# Altium schematic sheet MK76_HOST__A.SchDoc
size D; Organization: Altium Limited; Address1: 3 Minna Close; Address2: Belrose; Address3: NSW 2085; Address4: Australia; DocumentNumber: 1; SheetNumber: 1; SheetTotal: 1; PAGE_TITLE: TOP LEVEL
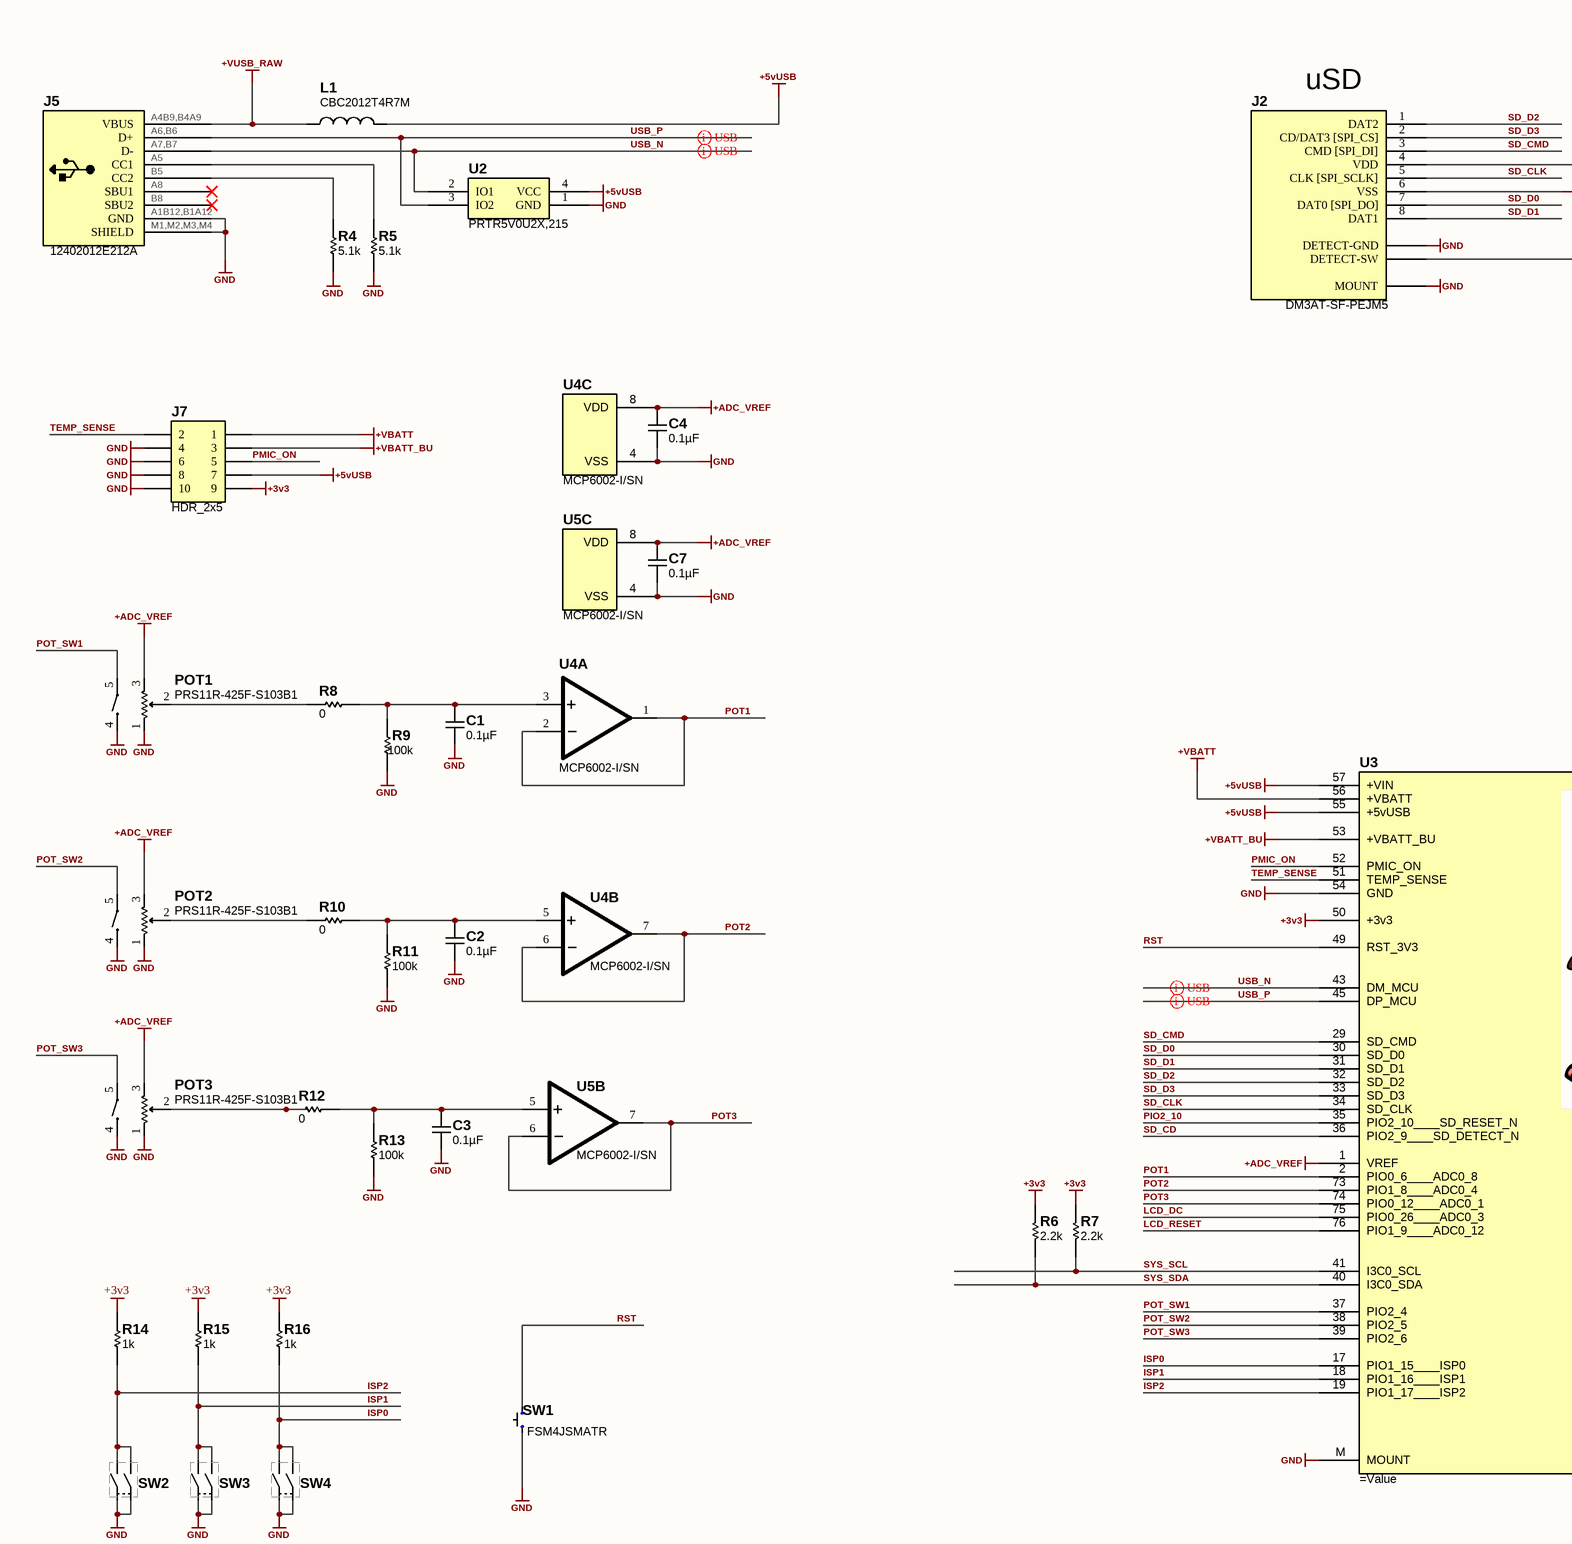
[diagram p0: MK76_HOST__A.SchDoc, top left]
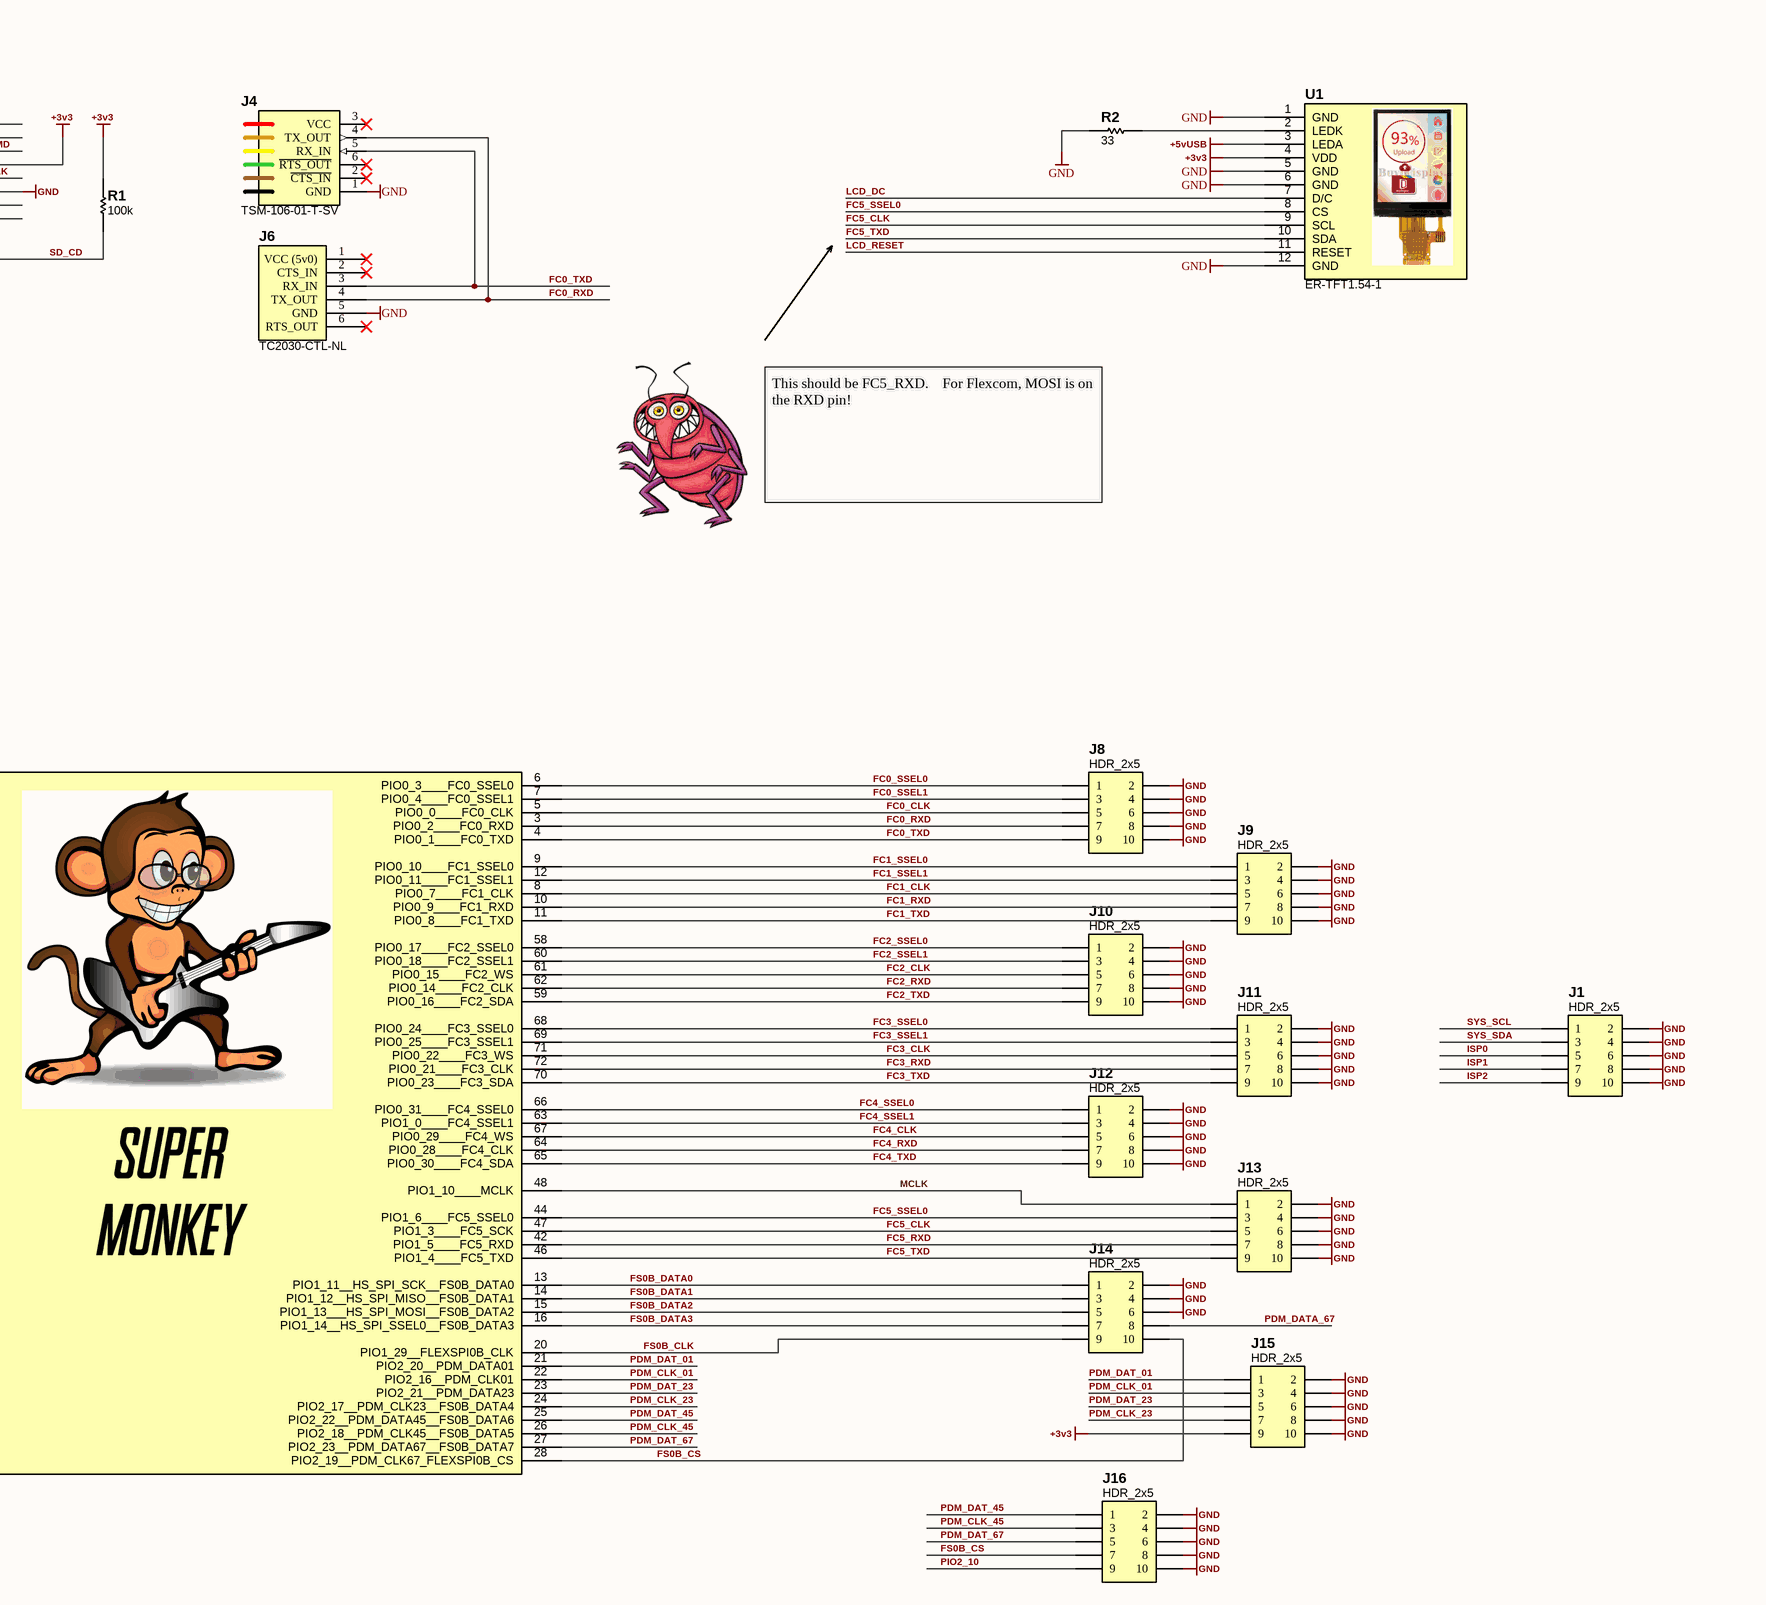
[diagram p1: MK76_HOST__A.SchDoc, top right]
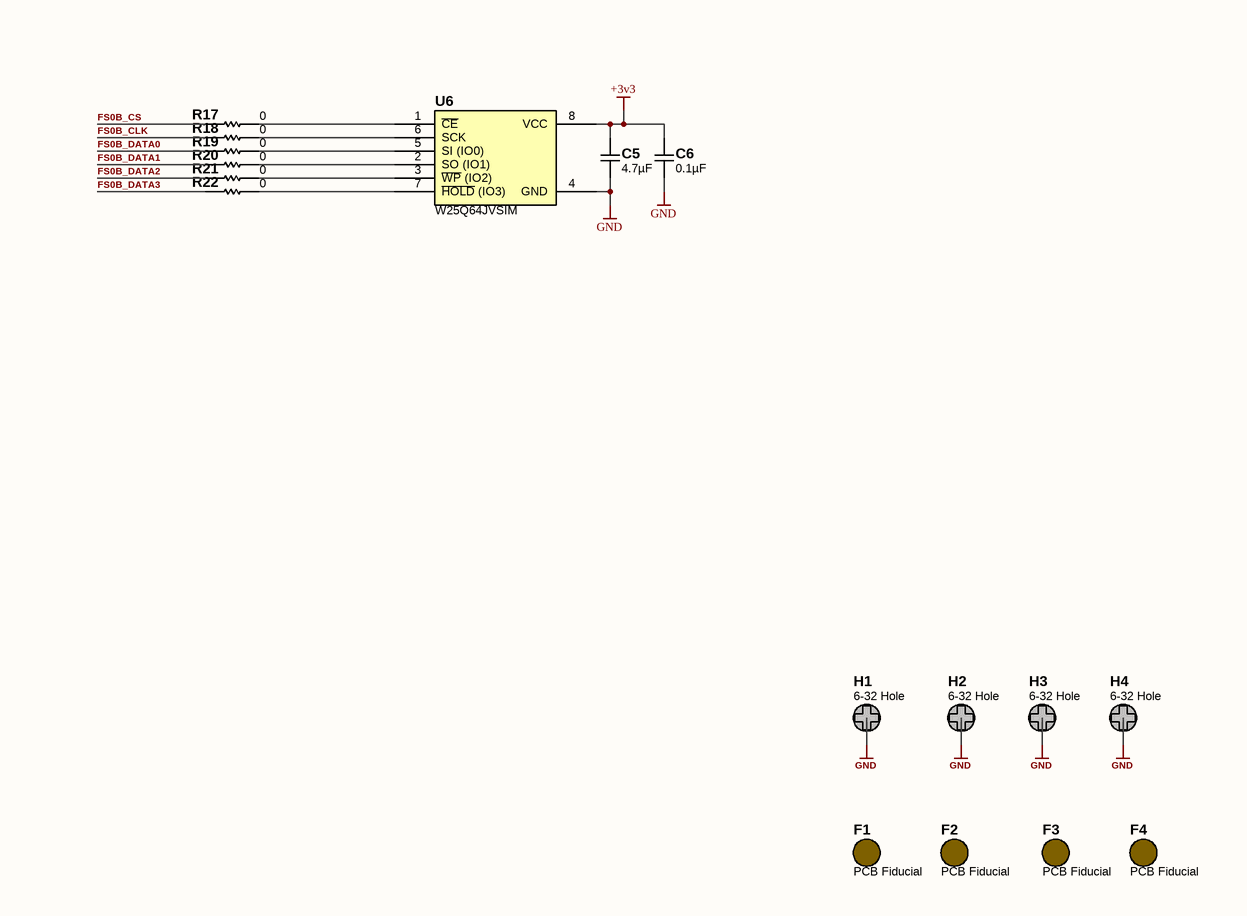
[diagram p2: MK76_HOST__A.SchDoc, bottom right]

## Parts
C1  0.1µF  [C0603_0.90MM_MD]
C2  0.1µF  [C0603_0.90MM_MD]
C3  0.1µF  [C0603_0.90MM_MD]
C4  0.1µF  [C0603_0.90MM_MD]
C5  4.7µF  [C0805_1.45MM_MD]
C6  0.1µF  [C0603_0.90MM_MD]
C7  0.1µF  [C0603_0.90MM_MD]
F1  PCB Fiducial  [Fiducial 1mm - 2mm]  (no BOM)
F2  PCB Fiducial  [Fiducial 1mm - 2mm]  (no BOM)
F3  PCB Fiducial  [Fiducial 1mm - 2mm]  (no BOM)
F4  PCB Fiducial  [Fiducial 1mm - 2mm]  (no BOM)
H1  6-32 Hole  [6-32 X 0]
H2  6-32 Hole  [6-32 X 0]
H3  6-32 Hole  [6-32 X 0]
H4  6-32 Hole  [6-32 X 0]
J1  HDR_2x5  [HEADER 2x5 .100"]
J2  DM3AT-SF-PEJM5  [DM3AT-SF-PEJM5]
J4  TSM-106-01-T-SV  [0901200126]
J5  12402012E212A  [12402012E212A]
J6  TC2030‐CTL‐NL  [TC2030]  (no BOM)
J7  HDR_2x5  [HEADER 2x5 .100"]
J8  HDR_2x5  [HEADER 2x5 .100"]
J9  HDR_2x5  [HEADER 2x5 .100"]
J10  HDR_2x5  [HEADER 2x5 .100"]
J11  HDR_2x5  [HEADER 2x5 .100"]
J12  HDR_2x5  [HEADER 2x5 .100"]
J13  HDR_2x5  [HEADER 2x5 .100"]
J14  HDR_2x5  [HEADER 2x5 .100"]
J15  HDR_2x5  [HEADER 2x5 .100"]
J16  HDR_2x5  [HEADER 2x5 .100"]
L1  CBC2012T4R7M  [C0805_1.45MM_MD]
POT1  PRS11R-425F-S103B1  [PRS11R425FS103B1]
POT2  PRS11R-425F-S103B1  [PRS11R425FS103B1]
POT3  PRS11R-425F-S103B1  [PRS11R425FS103B1]
R1  100k  [R0603_0.55MM_MD]
R2  33  [R0603_0.55MM_MD]
R4  5.1k  [R0603_0.55MM_MD]
R5  5.1k  [R0603_0.55MM_MD]
R6  2.2k  [R0603_0.55MM_MD]
R7  2.2k  [R0603_0.55MM_MD]
R8  0  [R0603_0.55MM_MD]
R9  100k  [R0603_0.55MM_MD]
R10  0  [R0603_0.55MM_MD]
R11  100k  [R0603_0.55MM_MD]
R12  0  [R0603_0.55MM_MD]
R13  100k  [R0603_0.55MM_MD]
R14  1k  [R0603_0.55MM_MD]
R15  1k  [R0603_0.55MM_MD]
R16  1k  [R0603_0.55MM_MD]
R17  0  [R0603_0.55MM_MD]
R18  0  [R0603_0.55MM_MD]
R19  0  [R0603_0.55MM_MD]
R20  0  [R0603_0.55MM_MD]
R21  0  [R0603_0.55MM_MD]
R22  0  [R0603_0.55MM_MD]
SW1  FSM4JSMATR  [FSM4JSMA]
SW2  SWITCH DIP DPST 1POS SMT  [CTS 1-POS DPST]  (value not drawn)
SW3  SWITCH DIP DPST 1POS SMT  [CTS 1-POS DPST]  (value not drawn)
SW4  SWITCH DIP DPST 1POS SMT  [CTS 1-POS DPST]  (value not drawn)
U1  ER-TFT1.54-1  [ER-TFT020-2 - FULL]
U2  PRTR5V0U2X,215  [SOT143B]
U3  (no value)  [RT_SUPER_C]
U4  MCP6002-I/SN  [SOIC 8]  (parts A,B,C of 3)
U5  MCP6002-I/SN  [SOIC 8]  (parts B,C of 3)
U6  W25Q64JVSIM  [SOIC127P830X200-8L]

## Nets
+3v3: C5.2 C6.2 J2.4(VDD) J7.9 J15.9 R1.2 R6.1 R7.1 R14.2 R15.2 R16.2 U1.4(VDD) U3.50(+3v3) U6.8(VCC)
+5vUSB: J7.7 L1.2 U1.3(LEDA) U2.4(VCC) U3.55(+5vUSB) U3.57(+VIN)
+ADC_VREF: C4.2 C7.2 POT1.3 POT2.3 POT3.3 U3.1(VREF) U4.8(VDD) U5.8(VDD)
+VBATT: J7.1 U3.56(+VBATT)
+VBATT_BU: J7.3 U3.53(+VBATT_BU)
+VUSB_RAW: J5.A4B9,B4A9(VBUS) L1.1
GND: C1.1 C2.1 C3.1 C4.1 C5.1 C6.1 C7.1 H1.1 H2.1 H3.1 H4.1 J1.2 J1.4 J1.6 J1.8 J1.10 J2.6(VSS) J2.CDA(DETECT-GND) J2.M(MOUNT) J4.1(GND) J5.A1B12,B1A12(GND) J5.M1,M2,M3,M4(SHIELD) J6.5(GND) J7.4 J7.6 J7.8 J7.10 J8.2 J8.4 J8.6 J8.8 J8.10 J9.2 J9.4 J9.6 J9.8 J9.10 J10.2 J10.4 J10.6 J10.8 J10.10 J11.2 J11.4 J11.6 J11.8 J11.10 J12.2 J12.4 J12.6 J12.8 J12.10 J13.2 J13.4 J13.6 J13.8 J13.10 J14.2 J14.4 J14.6 J15.2 J15.4 J15.6 J15.8 J15.10 J16.2 J16.4 J16.6 J16.8 J16.10 POT1.1 POT1.4 POT2.1 POT2.4 POT3.1 POT3.4 R2.1 R4.1 R5.1 R9.1 R11.1 R13.1 SW1.A SW2.2 SW2.4 SW3.2 SW3.4 SW4.2 SW4.4 U1.1(GND) U1.5(GND) U1.6(GND) U1.12(GND) U2.1(GND) U3.54(GND) U3.M(MOUNT) U4.4(VSS) U5.4(VSS) U6.4(GND)
FC0_CLK: J8.5 U3.5(PIO0_0____FC0_CLK)
FC0_RXD: J4.4(TX_OUT) J6.4(TX_OUT) J8.7 U3.3(PIO0_2____FC0_RXD)
FC0_SSEL0: J8.1 U3.6(PIO0_3____FC0_SSEL0)
FC0_SSEL1: J8.3 U3.7(PIO0_4____FC0_SSEL1)
FC0_TXD: J4.5(RX_IN) J6.3(RX_IN) J8.9 U3.4(PIO0_1____FC0_TXD)
FC1_CLK: J9.5 U3.8(PIO0_7____FC1_CLK)
FC1_RXD: J9.7 U3.10(PIO0_9____FC1_RXD)
FC1_SSEL0: J9.1 U3.9(PIO0_10____FC1_SSEL0)
FC1_SSEL1: J9.3 U3.12(PIO0_11____FC1_SSEL1)
FC1_TXD: J9.9 U3.11(PIO0_8____FC1_TXD)
FC2_CLK: J10.5 U3.61(PIO0_15____FC2_WS)
FC2_RXD: J10.7 U3.62(PIO0_14____FC2_CLK)
FC2_SSEL0: J10.1 U3.58(PIO0_17____FC2_SSEL0)
FC2_SSEL1: J10.3 U3.60(PIO0_18____FC2_SSEL1)
FC2_TXD: J10.9 U3.59(PIO0_16____FC2_SDA)
FC3_CLK: J11.5 U3.71(PIO0_22____FC3_WS)
FC3_RXD: J11.7 U3.72(PIO0_21____FC3_CLK)
FC3_SSEL0: J11.1 U3.68(PIO0_24____FC3_SSEL0)
FC3_SSEL1: J11.3 U3.69(PIO0_25____FC3_SSEL1)
FC3_TXD: J11.9 U3.70(PIO0_23____FC3_SDA)
FC4_CLK: J12.5 U3.67(PIO0_29____FC4_WS)
FC4_RXD: J12.7 U3.64(PIO0_28____FC4_CLK)
FC4_SSEL0: J12.1 U3.66(PIO0_31____FC4_SSEL0)
FC4_SSEL1: J12.3 U3.63(PIO1_0____FC4_SSEL1)
FC4_TXD: J12.9 U3.65(PIO0_30____FC4_SDA)
FC5_CLK: J13.5 U1.9(SCL) U3.47(PIO1_3____FC5_SCK)
FC5_RXD: J13.7 U3.42(PIO1_5____FC5_RXD)
FC5_SSEL0: J13.3 U1.8(CS) U3.44(PIO1_6____FC5_SSEL0)
FC5_TXD: J13.9 U1.10(SDA) U3.46(PIO1_4____FC5_TXD)
FS0B_CLK: J14.9 R18.1 U3.20(PIO1_29__FLEXSPI0B_CLK)
FS0B_CS: J14.10 J16.7 R17.1 U3.28(PIO2_19__PDM_CLK67_FLEXSPI0B_CS)
FS0B_DATA0: J14.1 R19.1 U3.13(PIO1_11__HS_SPI_SCK__FS0B_DATA0)
FS0B_DATA1: J14.3 R20.1 U3.14(PIO1_12__HS_SPI_MISO__FS0B_DATA1)
FS0B_DATA2: J14.5 R21.1 U3.15(PIO1_13___HS_SPI_MOSI__FS0B_DATA2)
FS0B_DATA3: J14.7 R22.1 U3.16(PIO1_14__HS_SPI_SSEL0__FS0B_DATA3)
ISP0: J1.5 R16.1 SW4.1 SW4.3 U3.17(PIO1_15____ISP0)
ISP1: J1.7 R15.1 SW3.1 SW3.3 U3.18(PIO1_16____ISP1)
ISP2: J1.9 R14.1 SW2.1 SW2.3 U3.19(PIO1_17____ISP2)
LCD_DC: U1.7(D/C) U3.75(PIO0_26____ADC0_3)
LCD_RESET: U1.11(RESET) U3.76(PIO1_9____ADC0_12)
MCLK: J13.1 U3.48(PIO1_10____MCLK)
PDM_CLK_01: J15.3 U3.22(PIO2_16__PDM_CLK01)
PDM_CLK_23: J15.7 U3.24(PIO2_17__PDM_CLK23__FS0B_DATA4)
PDM_CLK_45: J16.3 U3.26(PIO2_18__PDM_CLK45__FS0B_DATA5)
PDM_DAT_01: J15.1 U3.21(PIO2_20__PDM_DATA01)
PDM_DAT_23: J15.5 U3.23(PIO2_21__PDM_DATA23)
PDM_DAT_45: J16.1 U3.25(PIO2_22__PDM_DATA45__FS0B_DATA6)
PDM_DAT_67: J16.5 U3.27(PIO2_23__PDM_DATA67__FS0B_DATA7)
PDM_DATA_67: J14.8
PIO2_10: J16.9 U3.35(PIO2_10____SD_RESET_N)
PMIC_ON: J7.5 U3.52(PMIC_ON)
POT1: U3.2(PIO0_6____ADC0_8) U4.1(OUT) U4.2(-)
POT2: U3.73(PIO1_8____ADC0_4) U4.6(-) U4.7(OUT)
POT3: U3.74(PIO0_12____ADC0_1) U5.6(-) U5.7(OUT)
POT_SW1: POT1.5 U3.37(PIO2_4)
POT_SW2: POT2.5 U3.38(PIO2_5)
POT_SW3: POT3.5 U3.39(PIO2_6)
RST: SW1.B U3.49(RST_3V3)
SD_CD: J2.CDB(DETECT-SW) R1.1 U3.36(PIO2_9____SD_DETECT_N)
SD_CLK: J2.5(CLK_[SPI_SCLK]) U3.34(SD_CLK)
SD_CMD: J2.3(CMD_[SPI_DI]) U3.29(SD_CMD)
SD_D0: J2.7(DAT0_[SPI_DO]) U3.30(SD_D0)
SD_D1: J2.8(DAT1) U3.31(SD_D1)
SD_D2: J2.1(DAT2) U3.32(SD_D2)
SD_D3: J2.2(CD/DAT3_[SPI_CS]) U3.33(SD_D3)
SYS_SCL: J1.1 R7.2 U3.41(I3C0_SCL)
SYS_SDA: J1.3 R6.2 U3.40(I3C0_SDA)
TEMP_SENSE: J7.2 U3.51(TEMP_SENSE)
USB_N: J5.A7,B7(D-) U2.2(IO1) U3.43(DM_MCU)
USB_P: J5.A6,B6(D+) U2.3(IO2) U3.45(DP_MCU)
NetC1_2: C1.2 R8.2 R9.2 U4.3(+)
NetC2_2: C2.2 R10.2 R11.2 U4.5(+)
NetC3_2: C3.2 R12.2 R13.2 U5.5(+)
NetJ5_A5: J5.A5(CC1) R5.2
NetJ5_B5: J5.B5(CC2) R4.2
NetPOT1_2: POT1.2 R8.1
NetPOT2_2: POT2.2 R10.1
NetPOT3_2: POT3.2 R12.1
NetR2_2: R2.2 U1.2(LEDK)
NetR17_2: R17.2 U6.1(~{CE})
NetR18_2: R18.2 U6.6(SCK)
NetR19_2: R19.2 U6.5(SI_(IO0))
NetR20_2: R20.2 U6.2(SO_(IO1))
NetR21_2: R21.2 U6.3(~{WP}_(IO2))
NetR22_2: R22.2 U6.7(~{HOLD}_(IO3))

Not connected (* = marked no-connect by the designer): J4 2(~{CTS_IN})* 3(VCC)* 6(~{RTS_OUT})*; J5 A8(SBU1)* B8(SBU2)*; J6 1(VCC_(5v0))* 2(CTS_IN)* 6(RTS_OUT)*

## Layout directives
differential pair: USB_N, USB_P

## Notes on the sheet
- (near J2) uSD
- This should be FC5_RXD.    For Flexcom, MOSI is on the RXD pin!
- PCB REV
- CCA REV
- Sheet
- of

## Library data of the parts
C1-C4 C6 C7 = CGA3E2X7R1E104M080AA: CAP CER 0.1UF 25V X7R 0603; Manufacturer: TDK Corporation; Tolerance: ±20%; Substitution Notes: 0.1µF , 25V , ±20% , X7R , -55°C ~ 125°C , AEC-Q200 , 0603; Value: 0.1µF; Temperature Coefficient: X7R; Manufacturer Part Number: CGA3E2X7R1E104M080AA; ComponentLink1Description: Datasheet (Internal); ComponentLink1URL: datasheets\TDK\mlcc_automotive_general_en.pdf; ComponentLink2Description: Datasheet (External); ComponentLink2URL: https://product.tdk.com/info/en/catalog/datasheets/mlcc_automotive_general_en.pdf; Supplier 1: Digikey; Supplier Part Number 1: 445-12541-1-ND; Category: Capacitors; Voltage - Rated: 25V; Features: -; Operating Temperature: -55°C ~ 125°C; Ratings: AEC-Q200; Package: 0603; Thickness (Max): 0.90MM
C5 = CGA4J3X7R1A475K125AB: CAP CER 4.7UF 10V X7R 0805; Manufacturer: TDK Corporation; Tolerance: ±10%; Substitution Notes: 4.7µF , 10V , ±10% , X7R , -55°C ~ 125°C , AEC-Q200 , 0805; Value: 4.7µF; Temperature Coefficient: X7R; Manufacturer Part Number: CGA4J3X7R1A475K125AB; ComponentLink1Description: Datasheet (Internal); ComponentLink1URL: datasheets\TDK\mlcc_automotive_general_en.pdf; ComponentLink2Description: Datasheet (External); ComponentLink2URL: https://product.tdk.com/info/en/catalog/datasheets/mlcc_automotive_general_en.pdf; Supplier 1: Digikey; Supplier Part Number 1: 445-12730-1-ND; Category: Capacitors; Voltage - Rated: 10V; Operating Temperature: -55°C ~ 125°C; Ratings: AEC-Q200; Package: 0805; Thickness (Max): 1.45MM; Features: -
F1-F4 = Fiducial: Value: PCB Fiducial
H1-H4 = 6-32: Value: 6-32; Manufacturer: *; Manufacturer Part Number: *; Supplier 1: *; Supplier Part Number 1: *
J1 J7-J16 = HDR_2x5: 2x5 Header .100"; Pricing: 1=0.16000, 10=0.15400, 100=0.09510, 500=0.07872, 1000=0.06888, 5000=0.05904, 10000=0.05740 (USD); Value: HDR_2x5
J2 = DM3AT-SF-PEJM5: CONN MICRO SD R/A PUSH-PUSH SMD; Manufacturer: Hirose Electric Co Ltd; Card Type: Secure Digital - microSD™; Number of Positions: 10 (8 + 2); Connector Type: Connector and Ejector; Insertion, Removal Method: Push In, Push Out; Supplier 1: Digi-Key; Supplier Part Number 1: HR1964CT-ND; Manufacturer Part Number: DM3AT-SF-PEJM5; RoHS: RoHS Compliant; Category: Connectors, Interconnects; Stock: 28699; Pricing: 1=2.83, 10=2.72, 25=2.4932, 50=2.3798, 100=2.2664, 250=1.98312, 500=1.92648 (USD); Packaging: Cut Tape (CT); Ejector Side: -; Mounting Type: Surface Mount, Right Angle; Features: Switch; Height Above Board: 0.066" (1.68mm); Mounting Feature: Normal, Standard - Top; Contact Finish: Gold; Contact Finish Thickness: -; ComponentLink1URL: http://www.hirose.co.jp/cataloge_hp/e60900232.pdf; ComponentLink1Description: http://www.hirose.co.jp/cataloge_hp/e60900232.pdf; Value: DM3AT-SF-PEJM5
J4 = FTDI TTL-232R: CONN HEADER 6POS .100" SNGL SMD; Manufacturer: Samtec Inc.; CategorySort: 800; Connector Type: Header, Unshrouded; Number of Positions: 6; Number of Positions Loaded: All; Pitch: 0.100" (2.54mm); Category: Connectors; Value: TSM-106-01-T-SV; Supplier 1: Digi-Key; Supplier Part Number 1: SAM8987-ND; Manufacturer Part Number: TSM-106-01-T-SV; RoHS: RoHS Compliant; Stock 1: 137; Pricing 1: 1=0.69, 10=0.537, 50=0.455, 100=0.4095, 250=0.3458, 500=0.3276, 1000=0.2912, 2500=0.24206, 5000=0.2366 (USD); Packaging: Tube; Part Status: Active; Contact Type: Male Pin; Number of Rows: 1; Row Spacing: -; Contact Mating Length: 0.230" (5.84mm); Mounting Type: Surface Mount; Termination: Solder; Fastening Type: -; Features: -; Contact Finish: Tin; Contact Finish Thickness: -; Color: Black; ComponentLink1URL: http://suddendocs.samtec.com/prints/tsm-1xx-xx-xxx-sv-xx-xxx-xx-mkt.pdf; ComponentLink1Description: http://suddendocs.samtec.com/prints/tsm-1xx-xx-xxx-sv-xx-xxx-xx-mkt.pdf
J5 = 12402012E212A: Manufacturer: Amphenol; Supplier 1: Mouser; Supplier Part Number 1: 523-12402012E212A; Manufacturer Part Number: 12402012E212A; RoHS: No; Category: Connectors; Stock 1: 6869; Pricing: 1=0.98000, 10=0.77400, 50=0.77400, 100=0.67300, 1000=0.53800, 10000=0.43700 (USD); Value: 12402012E212A
J6 = TC2030-FTDI-TTL-232R-3V3: Tag Connect Pads - No latching Clips - ARM; Value: TC2030‐CTL‐NL
L1 = CBC2012T4R7M: FIXED IND 4.7UH 520MA 650 MOHM; Manufacturer: Taiyo Yuden; Core Material: Ferrite; Tolerance: 20%; Self Resonant Frequency: 45MHz; DC Resistance (DCR): 650mR; Test Frequency: 7.96MHz; Saturation Current: 360mA; Shielding: Unshielded; Value: CBC2012T4R7M; Supplier 1: Digi-Key; Manufacturer Part Number: CBC2012T4R7M; Stock 1: 7720; Pricing 1: 1=0.24000, 10=0.21600, 100=0.14860, 500=0.12702, 1000=0.09729 (USD); RoHS: Yes; Mount: Surface Mount; Case/Package: 0805; Number of Pins: 2; Case Code (Metric): 2012; Case Code (Imperial): 0805; Min Operating Temperature: -40°C; Max Operating Temperature: 105°C; Packaging: Tape and Reel; Inductance: 4.7uH; Max DC Current: 520mA; Termination: SMD/SMT; Inductance Tolerance: 20%; Package Quantity: 3000; Current Rating: 520mA; Composition: Wirewound; Length: 0.079inch; Height: 1.25mm; Width: 0.049inch; Height - Seated (Max): 0.057inch; REACH SVHC: No SVHC; Lead Free: Exempt; Halogen Free: Halogen Free; ComponentLink1URL: https://datasheet.ciiva.com/15981/214cbc2012t4r7m-15981637.pdf?src-supplier=Onlinecomponents.com; ComponentLink1Description: https://datasheet.ciiva.com/15981/214cbc2012t4r7m-15981637.pdf?src-supplier=Onlinecomponents.com; ComponentLink2URL: https://datasheet.ciiva.com/1040/cbc2012t4r7m-ss-1040456.pdf?src-supplier=Digi-Key; ComponentLink2Description: https://datasheet.ciiva.com/1040/cbc2012t4r7m-ss-1040456.pdf?src-supplier=Digi-Key; ComponentLink3URL: https://datasheet.ciiva.com/8505/cbc2012t4r7m-ss-8505656.pdf?src-supplier=Avnet; ComponentLink3Description: https://datasheet.ciiva.com/8505/cbc2012t4r7m-ss-8505656.pdf?src-supplier=Avnet; ComponentLink4URL: https://datasheet.ciiva.com/8001/wound02-e-8001849.pdf?src-supplier=Element14; ComponentLink4Description: https://datasheet.ciiva.com/8001/wound02-e-8001849.pdf?src-supplier=Element14; Supplier Part Number 1: 587-1602-1-ND
POT1-POT3 = PRS11R-425F-S103B1: 10k Pot w/ Momentary Switch - 25mm Length; Manufacturer: Bourns; Manufacturer Part Number: PRS11R-425F-S103B1; RoHS: No; Stock 1: 729; Pricing: 1=3.76000, 10=3.30000, 50=3.30000, 100=2.70000, 1000=1.82000, 10000=1.70000 (USD); Value: PRS11R-425F-S103B1; Supplier 1: Mouser; Supplier Part Number 1: 652-PRS11R425FS103B1
R1 R9 R11 R13 = ERJ-3EKF1003V: RES 100K OHM 1/10W 1% 0603 SMD; Manufacturer: Panasonic Electronic Components; Package Power: 0603  (0.1W); Power (Watts): 0.1W- 1/10W; Temperature Coefficient: ±100ppm/°C; Limiting Element Voltage: 75; Maximum Overload Voltage: 150; Maximum Working Voltage: 75.0V; Substitution Notes: 100k , ±1% , 0603 , AEC-Q200; Value: 100k; Manufacturer Part Number: ERJ-3EKF1003V; ComponentLink1Description: Internal Datasheet; ComponentLink1URL: datasheets\Panasonic Electronic Components\AOA0000CE2.pdf; ComponentLink2Description: External Datasheet; ComponentLink2URL: http://industrial.panasonic.com/www-data/pdf/AOA0000/AOA0000CE2.pdf; Supplier 1: Digi-Key; Supplier Part Number 1: P100KHCT-ND; Category: Resistors; Resistance (Ohms): 100k; Composition: Thick Film; Features: -; Tolerance: ±1%; Package: 0603 (1608 Metric); Supplier Package: 0603; Size / Dimension: 0.063" L x 0.031" W (1.60mm x 0.80mm); Height: 0.55MM; Number of Terminations: 2; Packaging: Cut Tape (CT); Sort Value: 100000; Sort Value Package: 603_100000; Ratings: AEC-Q200
R2 = ERJ-3EKF33R0V: RES 33 OHM 1/10W 1% 0603 SMD; Manufacturer: Panasonic Electronic Components; Package Power: 0603  (0.1W); Power (Watts): 0.1W- 1/10W; Temperature Coefficient: ±100ppm/°C; Limiting Element Voltage: 75; Maximum Overload Voltage: 150; Maximum Working Voltage: 1.8V; Substitution Notes: 33 , ±1% , 0603 , AEC-Q200; Value: 33; Manufacturer Part Number: ERJ-3EKF33R0V; ComponentLink1Description: Internal Datasheet; ComponentLink1URL: datasheets\Panasonic Electronic Components\AOA0000CE2.pdf; ComponentLink2Description: External Datasheet; ComponentLink2URL: http://industrial.panasonic.com/www-data/pdf/AOA0000/AOA0000CE2.pdf; Supplier 1: Digi-Key; Supplier Part Number 1: P33.0HCT-ND; Category: Resistors; Resistance (Ohms): 33; Composition: Thick Film; Features: -; Tolerance: ±1%; Package: 0603 (1608 Metric); Supplier Package: 0603; Size / Dimension: 0.063" L x 0.031" W (1.60mm x 0.80mm); Height: 0.55MM; Number of Terminations: 2; Packaging: Cut Tape (CT); Sort Value: 33; Sort Value Package: 603_33; Ratings: AEC-Q200
R4 R5 = ERJ-3EKF5101V: RES 5.1K OHM 1/10W 1% 0603 SMD; Manufacturer: Panasonic Electronic Components; Package Power: 0603  (0.1W); Power (Watts): 0.1W- 1/10W; Temperature Coefficient: ±100ppm/°C; Limiting Element Voltage: 75; Maximum Overload Voltage: 150; Maximum Working Voltage: 22.6V; Substitution Notes: 5.1k , ±1% , 0603 , AEC-Q200; Value: 5.1k; Manufacturer Part Number: ERJ-3EKF5101V; ComponentLink1Description: Internal Datasheet; ComponentLink1URL: datasheets\Panasonic Electronic Components\AOA0000CE2.pdf; ComponentLink2Description: External Datasheet; ComponentLink2URL: http://industrial.panasonic.com/www-data/pdf/AOA0000/AOA0000CE2.pdf; Supplier 1: Digi-Key; Supplier Part Number 1: P5.10KHCT-ND; Category: Resistors; Resistance (Ohms): 5.1k; Composition: Thick Film; Features: -; Tolerance: ±1%; Package: 0603 (1608 Metric); Supplier Package: 0603; Size / Dimension: 0.063" L x 0.031" W (1.60mm x 0.80mm); Height: 0.55MM; Number of Terminations: 2; Packaging: Cut Tape (CT); Sort Value: 5100; Sort Value Package: 603_5100; Ratings: AEC-Q200
R6 R7 = ERJ-3EKF2201V: RES 2.2K OHM 1/10W 1% 0603 SMD; Manufacturer: Panasonic Electronic Components; Package Power: 0603  (0.1W); Power (Watts): 0.1W- 1/10W; Temperature Coefficient: ±100ppm/°C; Limiting Element Voltage: 75; Maximum Overload Voltage: 150; Maximum Working Voltage: 14.8V; Substitution Notes: 2.2k , ±1% , 0603 , AEC-Q200; Value: 2.2k; Manufacturer Part Number: ERJ-3EKF2201V; ComponentLink1Description: Internal Datasheet; ComponentLink1URL: datasheets\Panasonic Electronic Components\AOA0000CE2.pdf; ComponentLink2Description: External Datasheet; ComponentLink2URL: http://industrial.panasonic.com/www-data/pdf/AOA0000/AOA0000CE2.pdf; Supplier 1: Digi-Key; Supplier Part Number 1: P2.20KHCT-ND; Category: Resistors; Resistance (Ohms): 2.2k; Composition: Thick Film; Features: -; Tolerance: ±1%; Package: 0603 (1608 Metric); Supplier Package: 0603; Size / Dimension: 0.063" L x 0.031" W (1.60mm x 0.80mm); Height: 0.55MM; Number of Terminations: 2; Packaging: Cut Tape (CT); Sort Value: 2200; Sort Value Package: 603_2200; Ratings: AEC-Q200
R8 R10 R12 R17-R22 = ERJ-3GEY0R00V: RES 0.0 OHM 1/10W JUMP 0603 SMD; Manufacturer: Panasonic Electronic Components; Package Power: 0603  (0.1W); Power (Watts): 0.1W- 1/10W; Tolerance: Jumper; Limiting Element Voltage: 75; Maximum Overload Voltage: 150; Maximum Working Voltage: 0.0V; Substitution Notes: 0 , Jumper , 0603 , AEC-Q200; Value: 0; Manufacturer Part Number: ERJ-3GEY0R00V; ComponentLink1Description: Internal Datasheet; ComponentLink1URL: datasheets\Panasonic Electronic Components\AOA0000CE1.pdf; ComponentLink2Description: External Datasheet; ComponentLink2URL: http://industrial.panasonic.com/www-data/pdf/AOA0000/AOA0000CE1.pdf; Supplier 1: Digi-Key; Supplier Part Number 1: P0.0GCT-ND; Category: Resistors; Resistance (Ohms): 0; Composition: Thick Film; Features: -; Temperature Coefficient: -; Package: 0603 (1608 Metric); Supplier Package: 0603; Size / Dimension: 0.063" L x 0.031" W (1.60mm x 0.80mm); Height: 0.55MM; Number of Terminations: 2; Sort Value: 0; Sort Value Package: 603_0; Ratings: AEC-Q200
R14-R16 = ERJ-3EKF1001V: RES 1K OHM 1/10W 1% 0603 SMD; Manufacturer: Panasonic Electronic Components; Package Power: 0603  (0.1W); Power (Watts): 0.1W- 1/10W; Temperature Coefficient: ±100ppm/°C; Limiting Element Voltage: 75; Maximum Overload Voltage: 150; Maximum Working Voltage: 10.0V; Substitution Notes: 1k , ±1% , 0603 , AEC-Q200; Value: 1k; Manufacturer Part Number: ERJ-3EKF1001V; ComponentLink1Description: Internal Datasheet; ComponentLink1URL: datasheets\Panasonic Electronic Components\AOA0000CE2.pdf; ComponentLink2Description: External Datasheet; ComponentLink2URL: http://industrial.panasonic.com/www-data/pdf/AOA0000/AOA0000CE2.pdf; Supplier 1: Digi-Key; Supplier Part Number 1: P1.00KHCT-ND; Category: Resistors; Resistance (Ohms): 1k; Composition: Thick Film; Features: -; Tolerance: ±1%; Package: 0603 (1608 Metric); Supplier Package: 0603; Size / Dimension: 0.063" L x 0.031" W (1.60mm x 0.80mm); Height: 0.55MM; Number of Terminations: 2; Packaging: Cut Tape (CT); Sort Value: 1000; Sort Value Package: 603_1000; Ratings: AEC-Q200
SW1 = FSM4JSMATR: SWITCH TACTILE SPST-NO 0.05A 12V; Manufacturer: TE Connectivity; Switch Function: Off-Mom; Contact Rating @ Voltage: 0.05A @ 12VDC; Actuator Type: Standard; Actuator Orientation: Top Actuated; Outline: 6.00mm x 6.00mm; Illumination: Non-Illuminated; Operating Force: 160gf; Supplier 1: Digi-Key; Supplier Part Number 1: 450-1759-1-ND; Manufacturer Part Number: FSM4JSMATR; RoHS: RoHS Compliant; Category: Switches; Stock 1: 35617; Pricing 1: 1=0.36, 10=0.34, 25=0.2912, 50=0.2474, 100=0.2377, 250=0.21344, 500=0.20374 (USD); Circuit: SPST-NO; Mounting Type: Surface Mount; Termination Style: Gull Wing; Packaging: Cut Tape (CT); ComponentLink1URL: http://documents.tycoelectronics.com/commerce/DocumentDelivery/DDEController?Action=srchrtrv&DocNm=2-1437565-7&DocType=CD&DocLang=EN; ComponentLink1Description: http://documents.tycoelectronics.com/commerce/DocumentDelivery/DDEController?Action=srchrtrv&DocNm=2-1437565-7&DocType=CD&DocLang=EN; Value: FSM4JSMATR
SW2-SW4 = 204-211ST: Manufacturer: CTS Corporation Resistor/Electrocomponents; Number of Positions: 1; Contact Rating @ Voltage: 0.1A @ 50VDC; Actuator Type: Standard; Actuator Level: Raised; Washable: Yes; Manufacturer Part Number: 204-211ST; ROHS Certificate: *; Value: 204-211ST; Supplier 1: Digi-Key; Supplier Part Number 1: CT204211ST-ND; RoHS: RoHS Compliant; Category: Switches; Stock 1: 8750; Pricing 1: 1=1.42, 10=1.134, 100=1.0024, 500=0.95486 (USD); Circuit: DPST; Mounting Type: Surface Mount; Orientation: Top Actuated; ComponentLink1URL: http://www.ctscorp.com/components/Datasheets/204.pdf; ComponentLink1Description: http://www.ctscorp.com/components/Datasheets/204.pdf
U1 = ER-TFT020-2: 2.0" 320x240 IPS Display; Manufacturer: Buy Display; Value: ER-TFT1.54-1; Manufacturer Part Number: ER-TFT1.54-1
U2 = PRTR5V0U2X,215: TVS DIODE 5.5VWM SOT143B; Manufacturer: NXP Semiconductors; Bidirectional Channels: 2; Voltage - Reverse Standoff (Typ): 5.5V (Max); Voltage - Breakdown (Min): 6V; Power Line Protection: Yes; Capacitance @ Frequency: 1pF @ 1MHz; Supplier 1: Digi-Key; Supplier Part Number 1: 568-4140-1-ND; Manufacturer Part Number: PRTR5V0U2X,215; RoHS: RoHS Compliant; Category: Circuit Protection; Stock: 11734; Pricing: 1=0.57, 10=0.477, 25=0.418, 100=0.3578, 250=0.31036, 500=0.26286, 1000=0.20265 (USD); Packaging: Cut Tape (CT); Type: Steering (Rail to Rail); Unidirectional Channels: -; Voltage - Clamping (Max) @ Ipp: -; Current - Peak Pulse (10/1000µs): -; Power - Peak Pulse: -; Applications: General Purpose; Operating Temperature: -40°C ~ 85°C (TA); Mounting Type: Surface Mount; Package / Case: TO-253-4, TO-253AA; Supplier Device Package: SOT-143B; ComponentLink1URL: http://www.nxp.com/documents/data_sheet/PRTR5V0U2X.pdf; ComponentLink1Description: http://www.nxp.com/documents/data_sheet/PRTR5V0U2X.pdf; Value: PRTR5V0U2X,215
U3 = RT_SUPER_C: Super Monkey Rev C
U4 U5 = MCP6002-I/SN: IC OPAMP 1.8V 1MHZ DUAL 8-SOIC; Manufacturer: Microchip Technology; Amplifier Type: General Purpose; Number of Circuits: 2; Output Type: Rail-to-Rail; Slew Rate: 0.6 V/µs; Current - Input Bias: 1pA; Voltage - Input Offset: 4.5mV; Current - Supply: 100µA; Current - Output / Channel: 23mA; Voltage - Supply, Single/Dual (±): 1.8 V ~ 6 V; Value: MCP6002-I/SN; Supplier 1: Digi-Key; Supplier Part Number 1: MCP6002-I/SN-ND; Manufacturer Part Number: MCP6002-I/SN; RoHS: RoHS Compliant; Category: Integrated Circuits (ICs); Stock 1: 45024; Pricing 1: 1=0.4, 10=0.33, 25=0.28, 100=0.25 (USD); Packaging: Tube; Gain Bandwidth Product: 1MHz; -3db Bandwidth: -; Operating Temperature: -40°C ~ 85°C; Mounting Type: Surface Mount; Package / Case: 8-SOIC (0.154", 3.90mm Width); Supplier Device Package: 8-SOIC N; ComponentLink1URL: http://ww1.microchip.com/downloads/en/DeviceDoc/21733j.pdf; ComponentLink1Description: http://ww1.microchip.com/downloads/en/DeviceDoc/21733j.pdf
U6 = W25Q128JVSIM: NOR Flash Serial (SPI, Dual SPI, Quad SPI) 3V/3.3V 128M-bit 16M x 8 6ns 8-Pin SOIC Tube; Manufacturer: Winbond; Manufacturer Part Number: W25Q64JVSSIQ; Memory Type: NOR,FLASH; Frequency: 104MHz; Interface: SPI,Serial; Max Supply Voltage: 3.6V; Min Supply Voltage: 2.7V; Page Size: 256B; Density: 64MB; Operating Supply Voltage: 3V; Address Bus Width: 24b; Memory Size: 128Mb; Value: W25Q64JVSIM; Supplier 1: Digi-Key; Supplier Part Number 1: W25Q128JVSIM-ND; Stock 1: 27539; Pricing 1: 1=1.88000, 10=1.71400, 25=1.66760, 50=1.65880, 100=1.48280, 250=1.47852, 500=1.45618, 1000=1.39437, 5000=1.29820 (USD); Mount: Surface Mount; Case/Package: SOIC; Min Operating Temperature: -40°C; Max Operating Temperature: 85°C; Packaging: Tray; Access Time: 6ns; ComponentLink1URL: http://www.winbond.com/resource-files/w25q64jv%20spi%20revg%2012142016.pdf; ComponentLink1Description: http://www.winbond.com/resource-files/w25q64jv%20spi%20revg%2012142016.pdf; ComponentLink2URL: https://www.winbond.com/resource-files/w25q64jv%20spi%20%20%20revc%2006032016%20kms.pdf; ComponentLink2Description: https://www.winbond.com/resource-files/w25q64jv%20spi%20%20%20revc%2006032016%20kms.pdf; RoHS: Yes; Category: Flash; RoHS Compliant: Yes; ComponentLink3URL: http://www.winbond.com/resource-files/w25q128jv_dtr%20revc%2003272018%20plus.pdf?src-supplier=Digi-Key; ComponentLink3Description: http://www.winbond.com/resource-files/w25q128jv_dtr%20revc%2003272018%20plus.pdf?src-supplier=Digi-Key